# Altium schematic sheet 8-8CONRTOL.SchDoc
size 508 x 241 mm
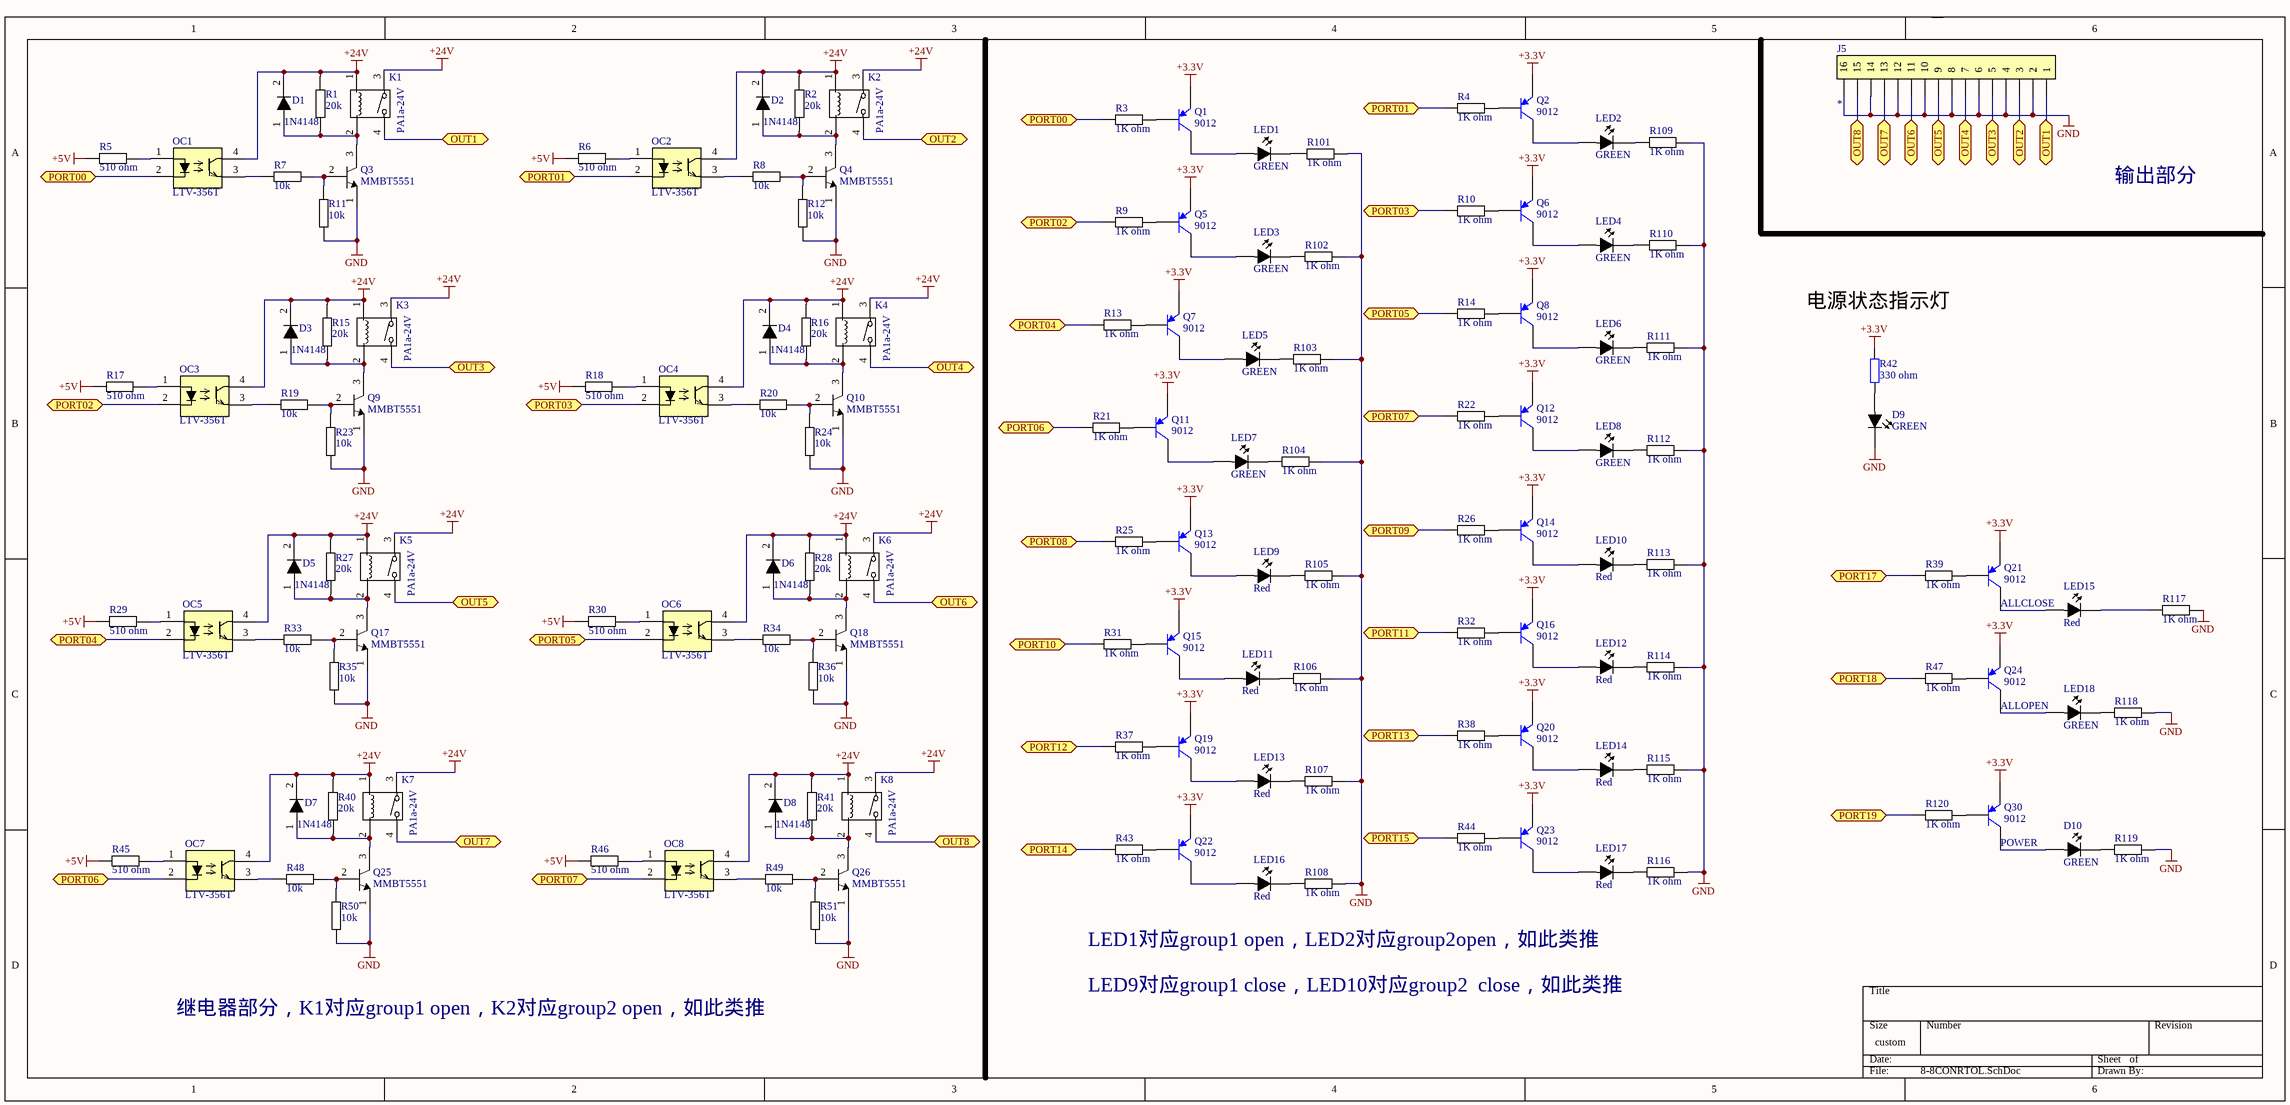
[diagram p0: 8-8CONRTOL.SchDoc]

## Parts
D1  1N4148  [D 1N4148(SOD-80/LL-34)]
D2  1N4148  [D 1N4148(SOD-80/LL-34)]
D3  1N4148  [D 1N4148(SOD-80/LL-34)]
D4  1N4148  [D 1N4148(SOD-80/LL-34)]
D5  1N4148  [D 1N4148(SOD-80/LL-34)]
D6  1N4148  [D 1N4148(SOD-80/LL-34)]
D7  1N4148  [D 1N4148(SOD-80/LL-34)]
D8  1N4148  [D 1N4148(SOD-80/LL-34)]
D9  GREEN  [0805 D]
D10  GREEN  [LED 3mm SIP]
J5  Header 1*16  [TIMECON5.1MMA]  (value not drawn)
K1  PA1a-24V  [Relay PA1a-24V]
K2  PA1a-24V  [Relay PA1a-24V]
K3  PA1a-24V  [Relay PA1a-24V]
K4  PA1a-24V  [Relay PA1a-24V]
K5  PA1a-24V  [Relay PA1a-24V]
K6  PA1a-24V  [Relay PA1a-24V]
K7  PA1a-24V  [Relay PA1a-24V]
K8  PA1a-24V  [Relay PA1a-24V]
LED1  GREEN  [LED 3mm SIP]
LED2  GREEN  [LED 3mm SIP]
LED3  GREEN  [LED 3mm SIP]
LED4  GREEN  [LED 3mm SIP]
LED5  GREEN  [LED 3mm SIP]
LED6  GREEN  [LED 3mm SIP]
LED7  GREEN  [LED 3mm SIP]
LED8  GREEN  [LED 3mm SIP]
LED9  Red  [LED 3mm SIP]
LED10  Red  [LED 3mm SIP]
LED11  Red  [LED 3mm SIP]
LED12  Red  [LED 3mm SIP]
LED13  Red  [LED 3mm SIP]
LED14  Red  [LED 3mm SIP]
LED15  Red  [LED 3mm SIP]
LED16  Red  [LED 3mm SIP]
LED17  Red  [LED 3mm SIP]
LED18  GREEN  [LED 3mm SIP]
OC1  LTV-356T  [SOP-4 LTV356T]
OC2  LTV-356T  [SOP-4 LTV356T]
OC3  LTV-356T  [SOP-4 LTV356T]
OC4  LTV-356T  [SOP-4 LTV356T]
OC5  LTV-356T  [SOP-4 LTV356T]
OC6  LTV-356T  [SOP-4 LTV356T]
OC7  LTV-356T  [SOP-4 LTV356T]
OC8  LTV-356T  [SOP-4 LTV356T]
Q1  9012  [9012  SOT-23/TO-236)]
Q2  9012  [9012  SOT-23/TO-236)]
Q3  MMBT5551  [MMBT5551(SOT-23/TO-236)]
Q4  MMBT5551  [MMBT5551(SOT-23/TO-236)]
Q5  9012  [9012  SOT-23/TO-236)]
Q6  9012  [9012  SOT-23/TO-236)]
Q7  9012  [9012  SOT-23/TO-236)]
Q8  9012  [9012  SOT-23/TO-236)]
Q9  MMBT5551  [MMBT5551(SOT-23/TO-236)]
Q10  MMBT5551  [MMBT5551(SOT-23/TO-236)]
Q11  9012  [9012  SOT-23/TO-236)]
Q12  9012  [9012  SOT-23/TO-236)]
Q13  9012  [9012  SOT-23/TO-236)]
Q14  9012  [9012  SOT-23/TO-236)]
Q15  9012  [9012  SOT-23/TO-236)]
Q16  9012  [9012  SOT-23/TO-236)]
Q17  MMBT5551  [MMBT5551(SOT-23/TO-236)]
Q18  MMBT5551  [MMBT5551(SOT-23/TO-236)]
Q19  9012  [9012  SOT-23/TO-236)]
Q20  9012  [9012  SOT-23/TO-236)]
Q21  9012  [9012  SOT-23/TO-236)]
Q22  9012  [9012  SOT-23/TO-236)]
Q23  9012  [9012  SOT-23/TO-236)]
Q24  9012  [9012  SOT-23/TO-236)]
Q25  MMBT5551  [MMBT5551(SOT-23/TO-236)]
Q26  MMBT5551  [MMBT5551(SOT-23/TO-236)]
Q30  9012  [9012  SOT-23/TO-236)]
R1  value 20k  [0805 R 1/8W]  (hidden comment: RES)
R2  value 20k  [0805 R 1/8W]  (hidden comment: RES)
R3  value 1K ohm  [0805 R 1/8W]  (hidden comment: RES)
R4  value 1K ohm  [0805 R 1/8W]  (hidden comment: RES)
R5  value 510 ohm  [0805 R 1/8W]  (hidden comment: RES)
R6  value 510 ohm  [0805 R 1/8W]  (hidden comment: RES)
R7  value 10k  [0805 R 1/8W]  (hidden comment: RES)
R8  value 10k  [0805 R 1/8W]  (hidden comment: RES)
R9  value 1K ohm  [0805 R 1/8W]  (hidden comment: RES)
R10  value 1K ohm  [0805 R 1/8W]  (hidden comment: RES)
R11  value 10k  [0805 R 1/8W]  (hidden comment: RES)
R12  value 10k  [0805 R 1/8W]  (hidden comment: RES)
R13  value 1K ohm  [0805 R 1/8W]  (hidden comment: RES)
R14  value 1K ohm  [0805 R 1/8W]  (hidden comment: RES)
R15  value 20k  [0805 R 1/8W]  (hidden comment: RES)
R16  value 20k  [0805 R 1/8W]  (hidden comment: RES)
R17  value 510 ohm  [0805 R 1/8W]  (hidden comment: RES)
R18  value 510 ohm  [0805 R 1/8W]  (hidden comment: RES)
R19  value 10k  [0805 R 1/8W]  (hidden comment: RES)
R20  value 10k  [0805 R 1/8W]  (hidden comment: RES)
R21  value 1K ohm  [0805 R 1/8W]  (hidden comment: RES)
R22  value 1K ohm  [0805 R 1/8W]  (hidden comment: RES)
R23  value 10k  [0805 R 1/8W]  (hidden comment: RES)
R24  value 10k  [0805 R 1/8W]  (hidden comment: RES)
R25  value 1K ohm  [0805 R 1/8W]  (hidden comment: RES)
R26  value 1K ohm  [0805 R 1/8W]  (hidden comment: RES)
R27  value 20k  [0805 R 1/8W]  (hidden comment: RES)
R28  value 20k  [0805 R 1/8W]  (hidden comment: RES)
R29  value 510 ohm  [0805 R 1/8W]  (hidden comment: RES)
R30  value 510 ohm  [0805 R 1/8W]  (hidden comment: RES)
R31  value 1K ohm  [0805 R 1/8W]  (hidden comment: RES)
R32  value 1K ohm  [0805 R 1/8W]  (hidden comment: RES)
R33  value 10k  [0805 R 1/8W]  (hidden comment: RES)
R34  value 10k  [0805 R 1/8W]  (hidden comment: RES)
R35  value 10k  [0805 R 1/8W]  (hidden comment: RES)
R36  value 10k  [0805 R 1/8W]  (hidden comment: RES)
R37  value 1K ohm  [0805 R 1/8W]  (hidden comment: RES)
R38  value 1K ohm  [0805 R 1/8W]  (hidden comment: RES)
R39  value 1K ohm  [0805 R 1/8W]  (hidden comment: RES)
R40  value 20k  [0805 R 1/8W]  (hidden comment: RES)
R41  value 20k  [0805 R 1/8W]  (hidden comment: RES)
R42  330 ohm  [0805 D]
R43  value 1K ohm  [0805 R 1/8W]  (hidden comment: RES)
R44  value 1K ohm  [0805 R 1/8W]  (hidden comment: RES)
R45  value 510 ohm  [0805 R 1/8W]  (hidden comment: RES)
R46  value 510 ohm  [0805 R 1/8W]  (hidden comment: RES)
R47  value 1K ohm  [0805 R 1/8W]  (hidden comment: RES)
R48  value 10k  [0805 R 1/8W]  (hidden comment: RES)
R49  value 10k  [0805 R 1/8W]  (hidden comment: RES)
R50  value 10k  [0805 R 1/8W]  (hidden comment: RES)
R51  value 10k  [0805 R 1/8W]  (hidden comment: RES)
R101  value 1K ohm  [0805 R 1/8W]  (hidden comment: RES)
R102  value 1K ohm  [0805 R 1/8W]  (hidden comment: RES)
R103  value 1K ohm  [0805 R 1/8W]  (hidden comment: RES)
R104  value 1K ohm  [0805 R 1/8W]  (hidden comment: RES)
R105  value 1K ohm  [0805 R 1/8W]  (hidden comment: RES)
R106  value 1K ohm  [0805 R 1/8W]  (hidden comment: RES)
R107  value 1K ohm  [0805 R 1/8W]  (hidden comment: RES)
R108  value 1K ohm  [0805 R 1/8W]  (hidden comment: RES)
R109  value 1K ohm  [0805 R 1/8W]  (hidden comment: RES)
R110  value 1K ohm  [0805 R 1/8W]  (hidden comment: RES)
R111  value 1K ohm  [0805 R 1/8W]  (hidden comment: RES)
R112  value 1K ohm  [0805 R 1/8W]  (hidden comment: RES)
R113  value 1K ohm  [0805 R 1/8W]  (hidden comment: RES)
R114  value 1K ohm  [0805 R 1/8W]  (hidden comment: RES)
R115  value 1K ohm  [0805 R 1/8W]  (hidden comment: RES)
R116  value 1K ohm  [0805 R 1/8W]  (hidden comment: RES)
R117  value 1K ohm  [0805 R 1/8W]  (hidden comment: RES)
R118  value 1K ohm  [0805 R 1/8W]  (hidden comment: RES)
R119  value 1K ohm  [0805 R 1/8W]  (hidden comment: RES)
R120  value 1K ohm  [0805 R 1/8W]  (hidden comment: RES)

## Ports
OUT1 (bidir), OUT2 (bidir), OUT3 (bidir), OUT4 (bidir), OUT5 (bidir), OUT6 (bidir), OUT7 (bidir), OUT8 (bidir), PORT00 (bidir), PORT01 (bidir), PORT02 (bidir), PORT03 (bidir), PORT04 (bidir), PORT05 (bidir), PORT06 (bidir), PORT07 (bidir), PORT08 (bidir), PORT09 (bidir), PORT10 (bidir), PORT11 (bidir), PORT12 (bidir), PORT13 (bidir), PORT14 (bidir), PORT15 (bidir), PORT17 (bidir), PORT18 (bidir), PORT19 (bidir)

## Nets
+3.3V: Q1.2(E) Q2.2(E) Q5.2(E) Q6.2(E) Q7.2(E) Q8.2(E) Q11.2(E) Q12.2(E) Q13.2(E) Q14.2(E) Q15.2(E) Q16.2(E) Q19.2(E) Q20.2(E) Q21.2(E) Q22.2(E) Q23.2(E) Q24.2(E) Q30.2(E) R42.2
+5V: R5.1 R6.1 R17.1 R18.1 R29.1 R30.1 R45.1 R46.1
+24V: D1.2(K) D2.2(K) D3.2(K) D4.2(K) D5.2(K) D6.2(K) D7.2(K) D8.2(K) K1.1 K1.3 K2.1 K2.3 K3.1 K3.3 K4.1 K4.3 K5.1 K5.3 K6.1 K6.3 K7.1 K7.3 K8.1 K8.3 OC1.4 OC2.4 OC3.4 OC4.4 OC5.4 OC6.4 OC7.4 OC8.4 R1.2 R2.2 R15.2 R16.2 R27.2 R28.2 R40.2 R41.2
GND: D9.2(K) J5.2 J5.4 J5.6 J5.8 J5.10 J5.12 J5.14 J5.16 Q3.1(E) Q4.1(E) Q9.1(E) Q10.1(E) Q17.1(E) Q18.1(E) Q25.1(E) Q26.1(E) R11.1 R12.1 R23.1 R24.1 R35.1 R36.1 R50.1 R51.1 R101.2 R102.2 R103.2 R104.2 R105.2 R106.2 R107.2 R108.2 R109.2 R110.2 R111.2 R112.2 R113.2 R114.2 R115.2 R116.2 R117.2 R118.2 R119.2
OUT1: J5.1 K1.4 ; port OUT1
OUT2: J5.3 K2.4 ; port OUT2
OUT3: J5.5 K3.4 ; port OUT3
OUT4: J5.7 K4.4 ; port OUT4
OUT5: J5.9 K5.4 ; port OUT5
OUT6: J5.11 K6.4 ; port OUT6
OUT7: J5.13 K7.4 ; port OUT7
OUT8: J5.15 K8.4 ; port OUT8
PORT00: OC1.2 R3.1 ; port PORT00
PORT01: OC2.2 R4.1 ; port PORT01
PORT02: OC3.2 R9.1 ; port PORT02
PORT03: OC4.2 R10.1 ; port PORT03
PORT04: OC5.2 R13.1 ; port PORT04
PORT05: OC6.2 R14.1 ; port PORT05
PORT06: OC7.2 R21.1 ; port PORT06
PORT07: OC8.2 R22.1 ; port PORT07
PORT08: R25.1 ; port PORT08
PORT09: R26.1 ; port PORT09
PORT10: R31.1 ; port PORT10
PORT11: R32.1 ; port PORT11
PORT12: R37.1 ; port PORT12
PORT13: R38.1 ; port PORT13
PORT14: R43.1 ; port PORT14
PORT15: R44.1 ; port PORT15
PORT17: R39.1 ; port PORT17
PORT18: R47.1 ; port PORT18
PORT19: R120.1 ; port PORT19
NetD1_1: D1.1(A) K1.2 Q3.3(C) R1.1
NetD2_1: D2.1(A) K2.2 Q4.3(C) R2.1
NetD3_1: D3.1(A) K3.2 Q9.3(C) R15.1
NetD4_1: D4.1(A) K4.2 Q10.3(C) R16.1
NetD5_1: D5.1(A) K5.2 Q17.3(C) R27.1
NetD6_1: D6.1(A) K6.2 Q18.3(C) R28.1
NetD7_1: D7.1(A) K7.2 Q25.3(C) R40.1
NetD8_1: D8.1(A) K8.2 Q26.3(C) R41.1
NetD9_1: D9.1(A) R42.1
NetD10_1: D10.1(A) Q30.3(C)
NetD10_2: D10.2(K) R119.1
NetLED1_1: LED1.1(A) Q1.3(C)
NetLED1_2: LED1.2(K) R101.1
NetLED2_1: LED2.1(A) Q2.3(C)
NetLED2_2: LED2.2(K) R109.1
NetLED3_1: LED3.1(A) Q5.3(C)
NetLED3_2: LED3.2(K) R102.1
NetLED4_1: LED4.1(A) Q6.3(C)
NetLED4_2: LED4.2(K) R110.1
NetLED5_1: LED5.1(A) Q7.3(C)
NetLED5_2: LED5.2(K) R103.1
NetLED6_1: LED6.1(A) Q8.3(C)
NetLED6_2: LED6.2(K) R111.1
NetLED7_1: LED7.1(A) Q11.3(C)
NetLED7_2: LED7.2(K) R104.1
NetLED8_1: LED8.1(A) Q12.3(C)
NetLED8_2: LED8.2(K) R112.1
NetLED9_1: LED9.1(A) Q13.3(C)
NetLED9_2: LED9.2(K) R105.1
NetLED10_1: LED10.1(A) Q14.3(C)
NetLED10_2: LED10.2(K) R113.1
NetLED11_1: LED11.1(A) Q15.3(C)
NetLED11_2: LED11.2(K) R106.1
NetLED12_1: LED12.1(A) Q16.3(C)
NetLED12_2: LED12.2(K) R114.1
NetLED13_1: LED13.1(A) Q19.3(C)
NetLED13_2: LED13.2(K) R107.1
NetLED14_1: LED14.1(A) Q20.3(C)
NetLED14_2: LED14.2(K) R115.1
NetLED15_1: LED15.1(A) Q21.3(C)
NetLED15_2: LED15.2(K) R117.1
NetLED16_1: LED16.1(A) Q22.3(C)
NetLED16_2: LED16.2(K) R108.1
NetLED17_1: LED17.1(A) Q23.3(C)
NetLED17_2: LED17.2(K) R116.1
NetLED18_1: LED18.1(A) Q24.3(C)
NetLED18_2: LED18.2(K) R118.1
NetOC1_1: OC1.1 R5.2
NetOC1_3: OC1.3 R7.1
NetOC2_1: OC2.1 R6.2
NetOC2_3: OC2.3 R8.1
NetOC3_1: OC3.1 R17.2
NetOC3_3: OC3.3 R19.1
NetOC4_1: OC4.1 R18.2
NetOC4_3: OC4.3 R20.1
NetOC5_1: OC5.1 R29.2
NetOC5_3: OC5.3 R33.1
NetOC6_1: OC6.1 R30.2
NetOC6_3: OC6.3 R34.1
NetOC7_1: OC7.1 R45.2
NetOC7_3: OC7.3 R48.1
NetOC8_1: OC8.1 R46.2
NetOC8_3: OC8.3 R49.1
NetQ1_1: Q1.1(B) R3.2
NetQ2_1: Q2.1(B) R4.2
NetQ3_2: Q3.2(B) R7.2 R11.2
NetQ4_2: Q4.2(B) R8.2 R12.2
NetQ5_1: Q5.1(B) R9.2
NetQ6_1: Q6.1(B) R10.2
NetQ7_1: Q7.1(B) R13.2
NetQ8_1: Q8.1(B) R14.2
NetQ9_2: Q9.2(B) R19.2 R23.2
NetQ10_2: Q10.2(B) R20.2 R24.2
NetQ11_1: Q11.1(B) R21.2
NetQ12_1: Q12.1(B) R22.2
NetQ13_1: Q13.1(B) R25.2
NetQ14_1: Q14.1(B) R26.2
NetQ15_1: Q15.1(B) R31.2
NetQ16_1: Q16.1(B) R32.2
NetQ17_2: Q17.2(B) R33.2 R35.2
NetQ18_2: Q18.2(B) R34.2 R36.2
NetQ19_1: Q19.1(B) R37.2
NetQ20_1: Q20.1(B) R38.2
NetQ21_1: Q21.1(B) R39.2
NetQ22_1: Q22.1(B) R43.2
NetQ23_1: Q23.1(B) R44.2
NetQ24_1: Q24.1(B) R47.2
NetQ25_2: Q25.2(B) R48.2 R50.2
NetQ26_2: Q26.2(B) R49.2 R51.2
NetQ30_1: Q30.1(B) R120.2

## Notes on the sheet
- 输出部分
- 电源状态指示灯
- (near Q21) ALLCLOSE
- (near Q24) ALLOPEN
- (near Q30) POWER
- LED1对应group1 open，LED2对应group2open，如此类推
- LED9对应group1 close，LED10对应group2  close，如此类推
- 继电器部分，K1对应group1 open，K2对应group2 open，如此类推

## Library data of the parts
D1-D8 = Diode
D9 D10 LED1-LED18 = LED
K1-K8 = Relay
OC1-OC8 = Opto1
Q1 Q2 Q5-Q8 Q11-Q16 Q19-Q24 Q30 = PNP: PNP Bipolar Transistor; Published: 8-Jun-2000; LatestRevisionDate: 29-May-2009; LatestRevisionNote: IPC-7351 Footprint Added.; PackageVersion: Aug-1999; PackageReference: SOT-23B; Publisher: Altium Limited; PackageDescription: 3-Pin SOT-23 Package 0.95 mm Pitch, 2.4 mm Lead Span
Q3 Q4 Q9 Q10 Q17 Q18 Q25 Q26 = NPN
R42 = Res2: Resistor; Value: 103; Published: 8-Jun-2000; LatestRevisionDate: 17-Jul-2002; LatestRevisionNote: Re-released for DXP Platform.; PackageReference: AXIAL-0.4; Publisher: Altium Limited
J5 = Header 1*16: Pin: *